# EAGLE design IDC (EAGLE 6.0)
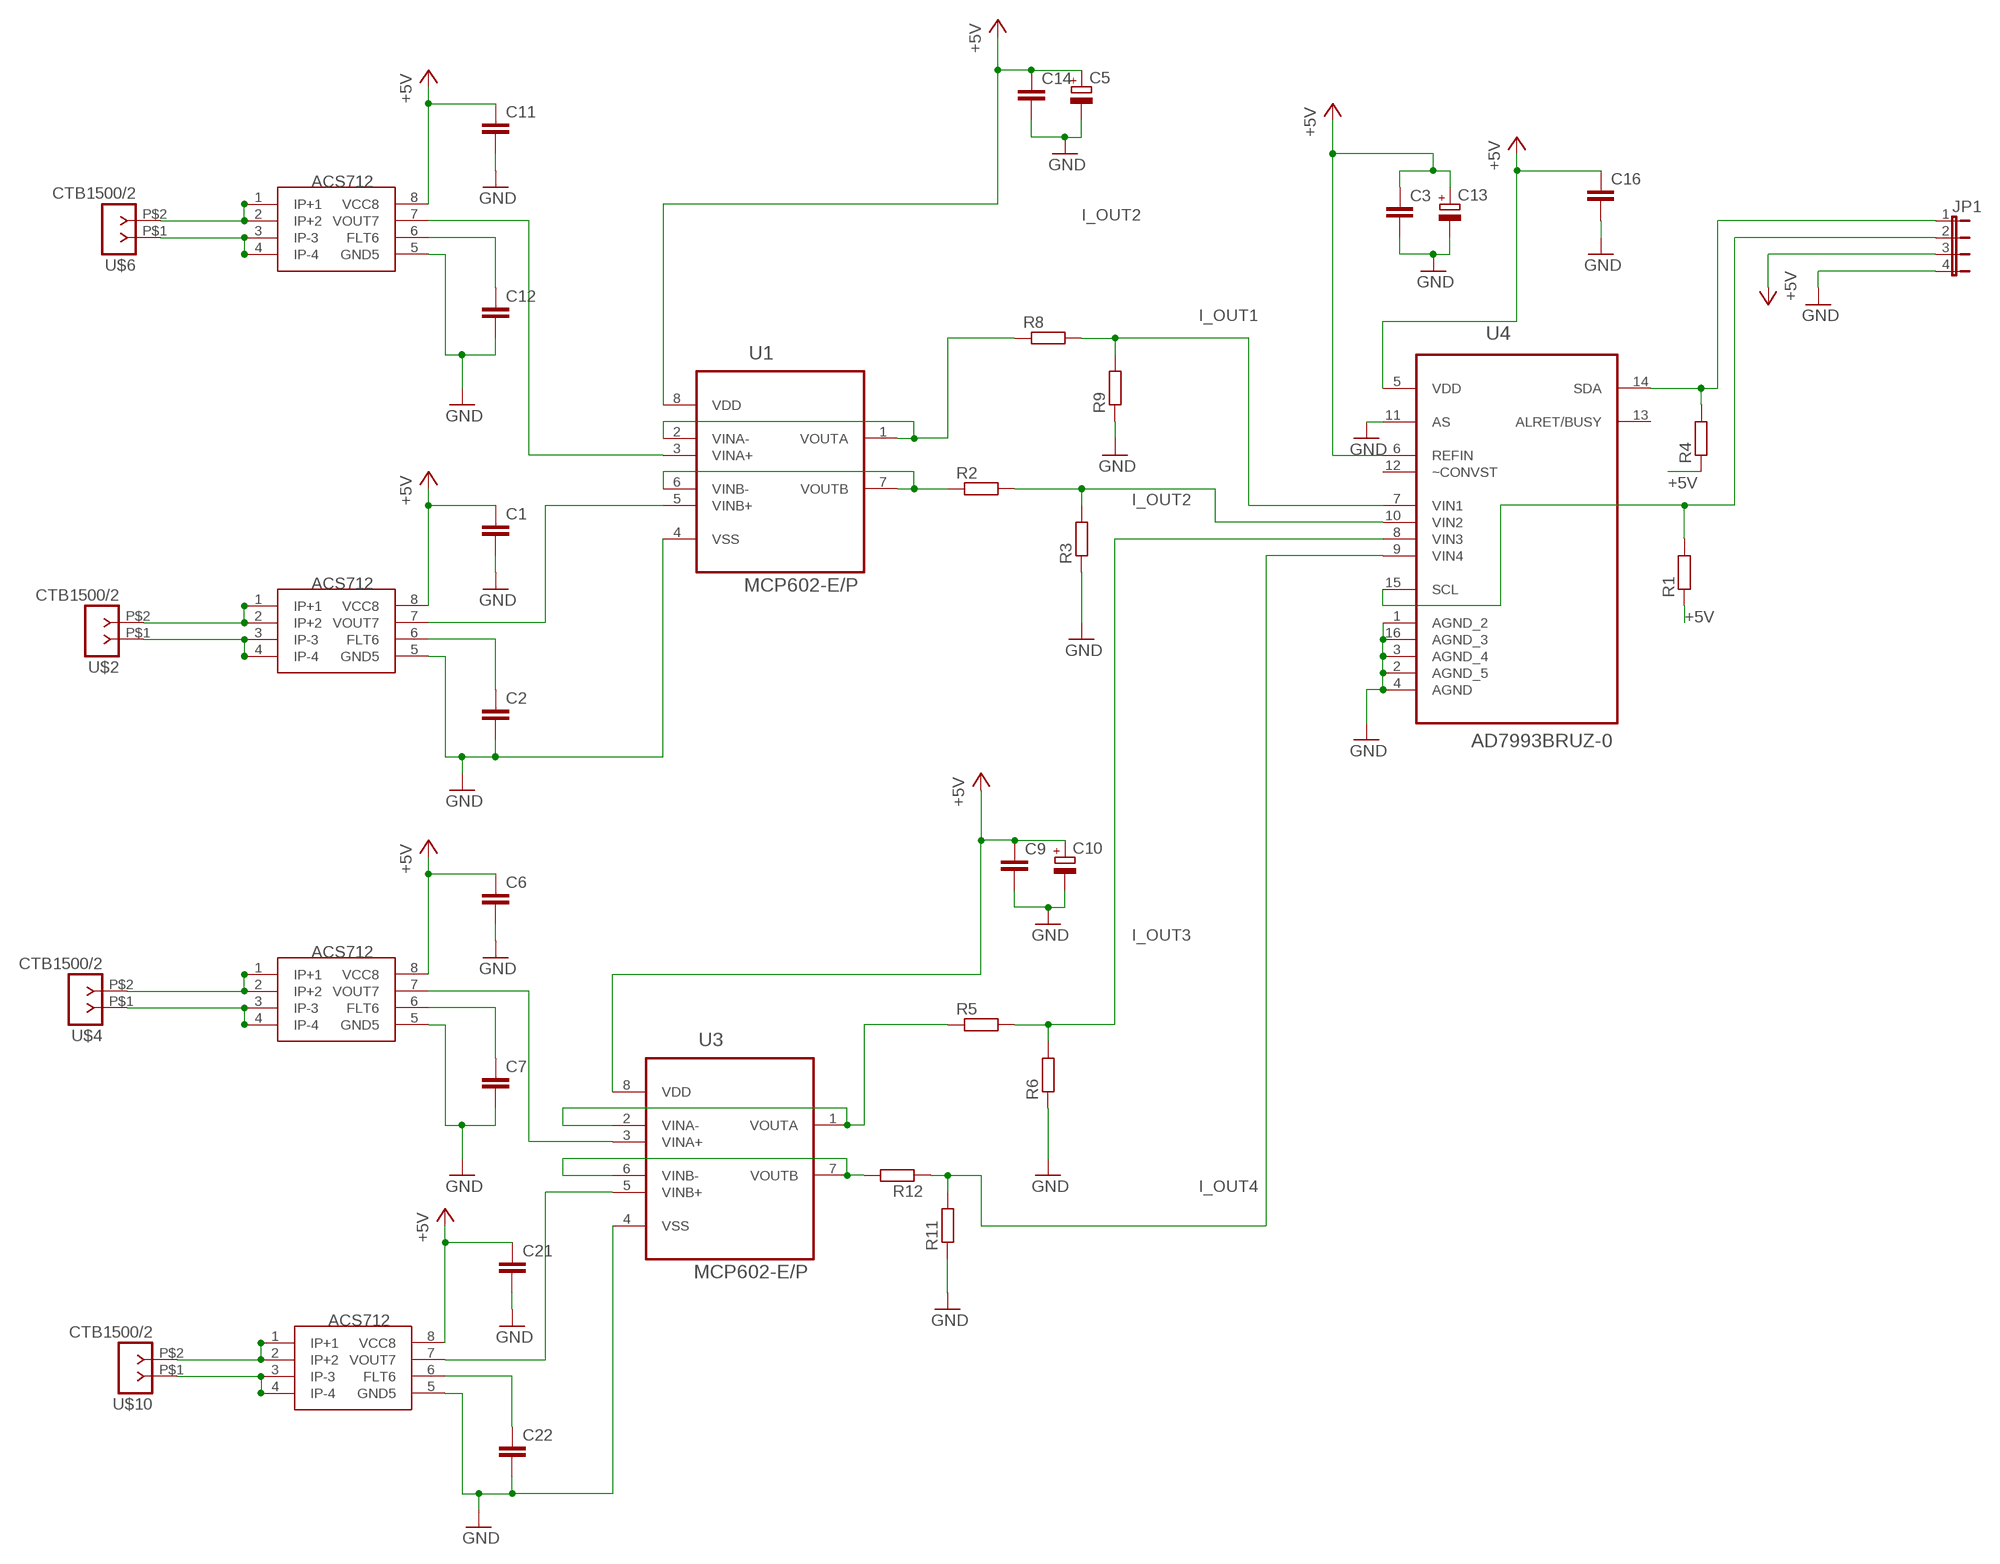
[diagram p0: schematic, sheet 1]

## Parts
C1  C-EU025-024X044  [C025-024X044]
C2  C-EU025-024X044  [C025-024X044]
C3  C-EU025-024X044  [C025-024X044]
C5  CPOL-EUE2-4  [E2-4]
C6  C-EU025-024X044  [C025-024X044]
C7  C-EU025-024X044  [C025-024X044]
C9  C-EU025-024X044  [C025-024X044]
C10  CPOL-EUE2-4  [E2-4]
C11  C-EU025-024X044  [C025-024X044]
C12  C-EU025-024X044  [C025-024X044]
C13  CPOL-EUE2-4  [E2-4]
C14  C-EU025-024X044  [C025-024X044]
C16  C-EU025-025X050  [C025-025X050]
C21  C-EU025-024X044  [C025-024X044]
C22  C-EU025-024X044  [C025-024X044]
JP1  JP4E  [JP4]
R1  R-EU_0207/7  [0207/7]
R2  R-EU_0207/7  [0207/7]
R3  R-EU_0207/7  [0207/7]
R4  R-EU_0207/7  [0207/7]
R5  R-EU_0207/7  [0207/7]
R6  R-EU_0207/7  [0207/7]
R8  R-EU_0207/7  [0207/7]
R9  R-EU_0207/7  [0207/7]
R11  R-EU_0207/7  [0207/7]
R12  R-EU_0207/7  [0207/7]
U1  MCP602-E/P  [DIP254P762X508-8P]
U3  MCP602-E/P  [DIP254P762X508-8P]
U4  AD7993BRUZ-0  [SOP65P640X120-16N]
U$1  ACS712  [SO8]
U$2  CTB1500/2  [CTB1500-2]
U$3  ACS712  [SO8]
U$4  CTB1500/2  [CTB1500-2]
U$5  ACS712  [SO8]
U$6  CTB1500/2  [CTB1500-2]
U$9  ACS712  [SO8]
U$10  CTB1500/2  [CTB1500-2]

## Nets
+5V: C1.1 C3.1 C5.+ C6.1 C9.1 C10.+ C11.1 C13.+ C14.1 C16.1 C21.1 JP1.3 R1.1 R4.1 U1.8(VDD) U3.8(VDD) U4.5(VDD) U4.6(REFIN) U$1.8(VCC8) U$3.8(VCC8) U$5.8(VCC8) U$9.8(VCC8)
GND: C1.2 C2.2 C3.2 C5.- C6.2 C7.2 C9.2 C10.- C11.2 C12.2 C13.- C14.2 C16.2 C21.2 C22.2 JP1.4 R3.1 R6.1 R9.1 R11.1 U1.4(VSS) U3.4(VSS) U4.1(AGND_2) U4.2(AGND_5) U4.3(AGND_4) U4.4(AGND) U4.11(AS) U4.16(AGND_3) U$1.5(GND5) U$3.5(GND5) U$5.5(GND5) U$9.5(GND5)
I_OUT: R2.1 U1.6(VINB-) U1.7(VOUTB)
I_OUT1: R8.2 R9.2 U4.7(VIN1)
I_OUT2: R2.2 R3.2 R8.1 U1.1(VOUTA) U1.2(VINA-) U4.10(VIN2)
I_OUT3: R5.2 R6.2 U4.8(VIN3)
I_OUT4: R11.2 R12.1 U4.9(VIN4)
N$1: JP1.1 R4.2 U4.14(SDA)
N$2: U$1.3(IP-3) U$1.4(IP-4) U$2.P$1
N$3: JP1.2 R1.2 U4.15(SCL)
N$4: C2.1 U$1.6(FLT6)
N$5: U$3.3(IP-3) U$3.4(IP-4) U$4.P$1
N$6: U3.5(VINB+) U$9.7(VOUT7)
N$8: C7.1 U$3.6(FLT6)
N$9: U1.5(VINB+) U$1.7(VOUT7)
N$11: R5.1 U3.1(VOUTA) U3.2(VINA-)
N$12: U3.3(VINA+) U$3.7(VOUT7)
N$14: U$5.3(IP-3) U$5.4(IP-4) U$6.P$1
N$15: C12.1 U$5.6(FLT6)
N$16: U$5.1(IP+1) U$5.2(IP+2) U$6.P$2
N$17: U$1.1(IP+1) U$1.2(IP+2) U$2.P$2
N$18: U1.3(VINA+) U$5.7(VOUT7)
N$19: U$3.1(IP+1) U$3.2(IP+2) U$4.P$2
N$20: U$9.1(IP+1) U$9.2(IP+2) U$10.P$2
N$21: R12.2 U3.6(VINB-) U3.7(VOUTB)
N$26: U$9.3(IP-3) U$9.4(IP-4) U$10.P$1
N$27: C22.1 U$9.6(FLT6)
Unconnected: U4.12(~CONVST) U4.13(ALRET/BUSY)

## Library data of the parts
C1-C3 C6 C7 C9 C11 C12 C14 C16 C21 C22 = resistor:C-EU: CAPACITOR, European symbol
C5 C10 C13 = resistor:CPOL-EU: POLARIZED CAPACITOR, European symbol
JP1 = jumper:JP4E: JUMPER
R1-R6 R8 R9 R11 R12 = resistor:R-EU_: RESISTOR, European symbol
U1 U3 = MCP:MCP602-E/P: IC, 2.7V to 5.5V Single-Supply CMOS Dual Op Amps,DIP-8; MPN: MCP602-E/P; OC_FARNELL: 1852042; OC_NEWARK: 88H9870; PACKAGE: DIP-8; SUPPLIER: Microchip
U4 = ADC:AD7993BRUZ-0: ADC; MPN: AD7993BRUZ-0; OC_FARNELL: 1078309; OC_NEWARK: 59K6101; PACKAGE: TSSOP-16; SUPPLIER: Analog Devices
U$1 U$3 U$5 U$9 = eko-parts:ACS712
U$2 U$4 U$6 U$10 = eko-parts:CTB1500/2

## Board
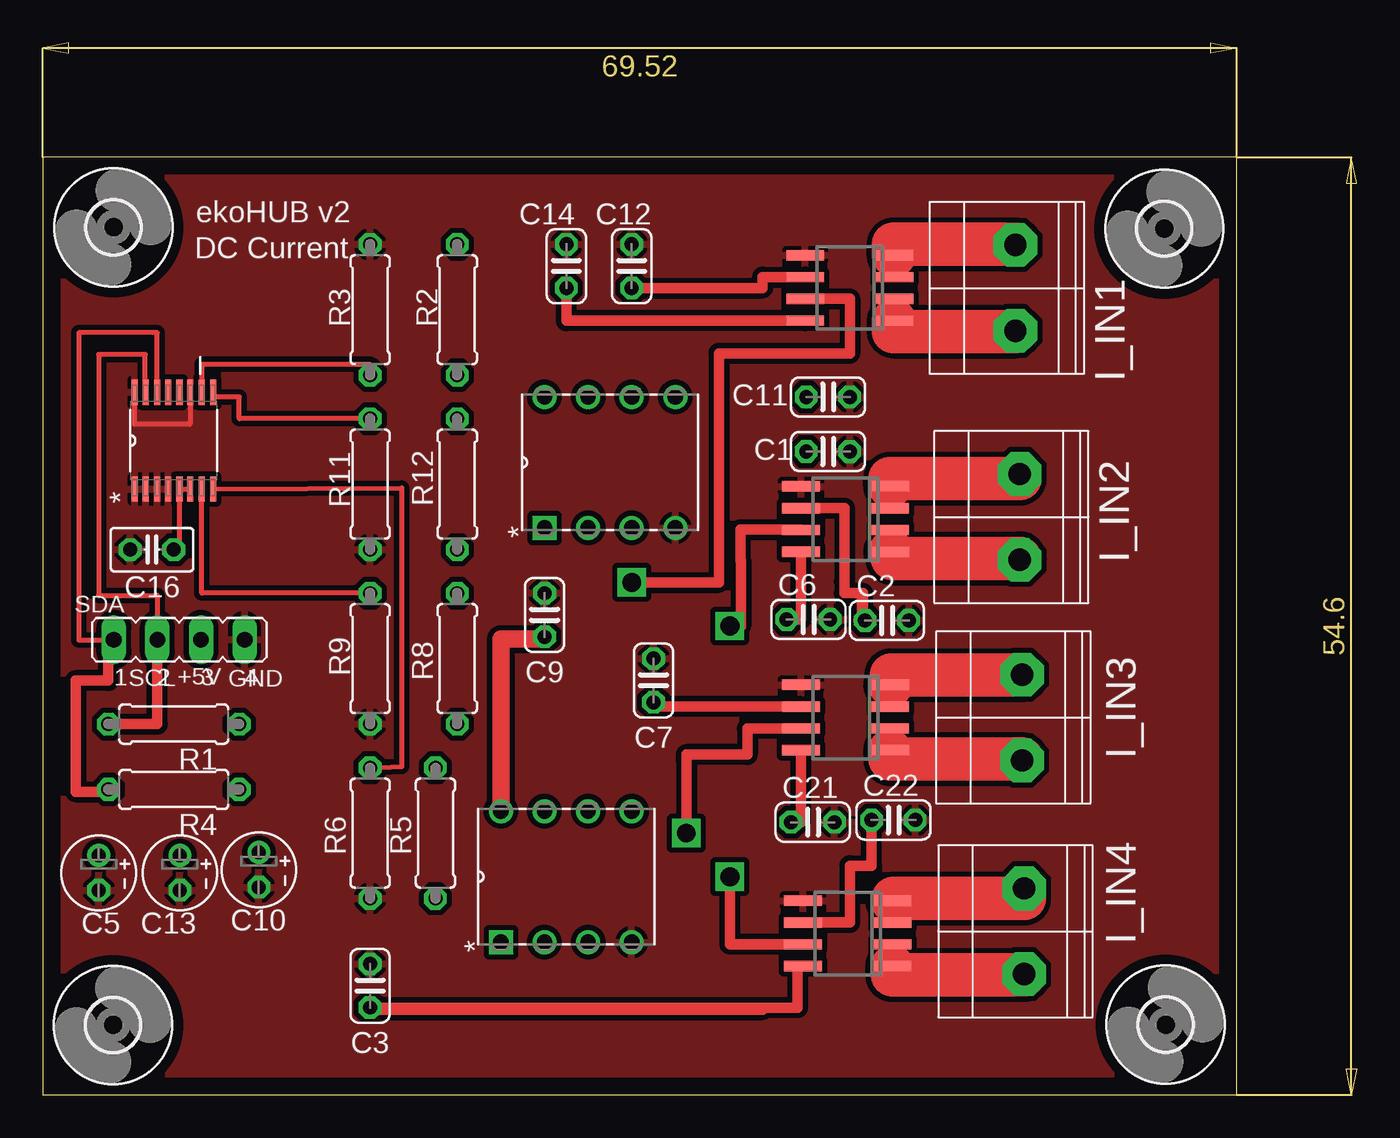
[diagram p1: board, top side]
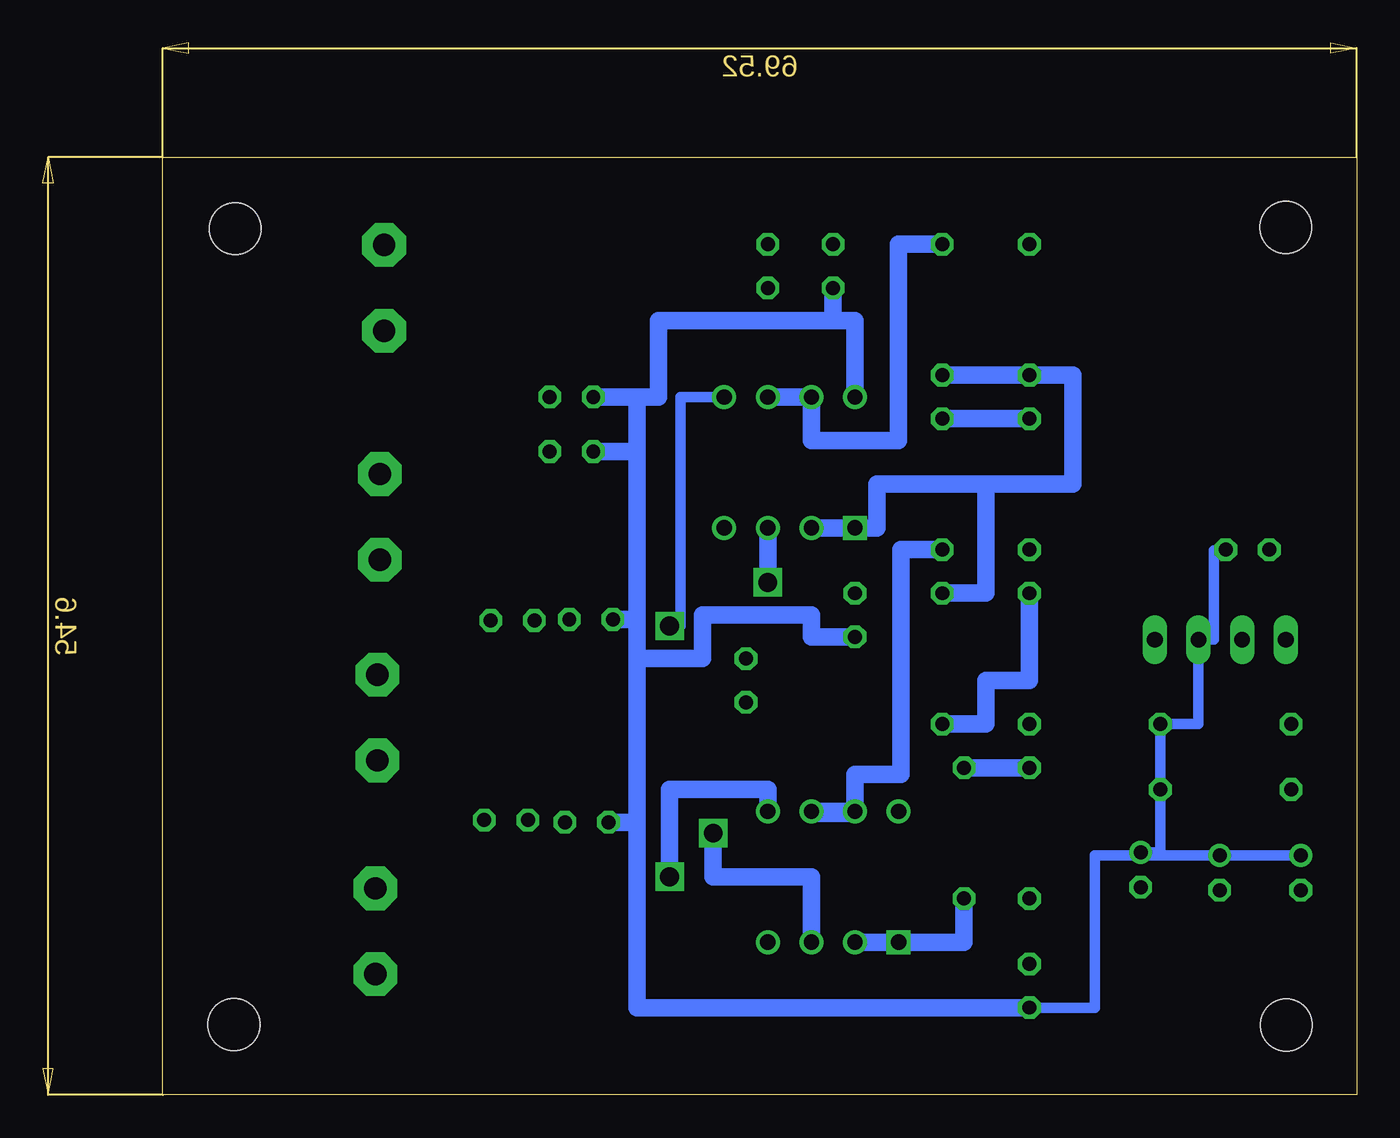
[diagram p2: board, bottom side, seen from below]

Size 69.52 x 54.6 mm. Coordinates in mm from the lower left corner, seen from the top.
Outline: 0,0 69.52,0 69.52,54.6 0,54.6 0,0
Copper layers (1*16): Top 0.035mm / dielectric 1.5mm / Bottom 0.035mm
Design rules: minimum track width 10mil, minimum drill 24mil, track to track 12mil, track to pad 12mil, pad to pad 12mil, via to via 12mil, smd to smd 12mil, copper to edge 40mil, drill to drill 8mil, minimum pad ring 10mil, minimum via ring 8mil, stop-mask expansion 4mil, vias tented up to drill 0mil, thermal gap 10mil

### Footprints (pad centres in the part's own frame; a part is rotated, then mirrored left to right if it is on the bottom)
C025-024X044 = drill 0.813 octagon: 1 -1.27,0; 2 1.27,0
E2-4 = drill 0.813 pad 1.27: + -1.016,0 | drill 0.813 pad 1.27 octagon: - 1.016,0
C025-025X050 = drill 0.813 octagon: 1 -1.27,0; 2 1.27,0
JP4 = drill 0.914 long: 1 -3.81,0; 2 -1.27,0; 3 1.27,0; 4 3.81,0
0207/7 = drill 0.813 octagon: 1 -3.81,0; 2 3.81,0
DIP254P762X508-8P = drill 0.889 square: 1 -7.62,7.62 | drill 0.889: 2 -7.62,5.08; 3 -7.62,2.54; 4 -7.62,0; 5 0,0; 6 0,2.54; 7 0,5.08; 8 0,7.62
SOP65P640X120-16N = smd 1.473 x 0.356: 1 -2.819,2.286; 2 -2.819,1.626; 3 -2.819,0.965; 4 -2.819,0.33; 5 -2.819,-0.33; 6 -2.819,-0.965; 7 -2.819,-1.626; 8 -2.819,-2.286; 9 2.819,-2.286; 10 2.819,-1.626; 11 2.819,-0.965; 12 2.819,-0.33; 13 2.819,0.33; 14 2.819,0.965; 15 2.819,1.626; 16 2.819,2.286
SO8 = smd 0.6 x 2.2: 1 -1.905,-2.6; 2 -0.635,-2.6; 3 0.635,-2.6; 4 1.905,-2.6; 5 1.905,2.6; 6 0.635,2.6; 7 -0.635,2.6; 8 -1.905,2.6
CTB1500-2 = drill 1.3 pad 2.54 octagon: P$1 -2.5,0.5; P$2 2.5,0.5
3,0 = hole 3: 0,0

### Placement (x,y rotation side)
C1  45.72,37.47 0 top
C2  49.15,27.62 0 top
C3  19.05,6.35 90 top
C5  3.25,12.93 270 top
C6  44.58,27.69 0 top
C7  35.56,24.13 90 top
C9  29.21,27.94 90 top
C10  12.57,13.11 270 top
C11  45.72,40.64 0 top
C12  34.29,48.26 90 top
C13  7.98,12.93 270 top
C14  30.48,48.26 90 top
C16  6.35,31.75 180 top
C21  44.83,15.88 0 top
C22  49.53,16 0 top
JP1  7.94,26.5 0 top
R1  7.62,21.59 180 top
R2  24.13,45.72 270 top
R3  19.05,45.72 270 top
R4  7.62,17.78 180 top
R5  22.86,15.24 90 top
R6  19.05,15.24 90 top
R8  24.13,25.4 270 top
R9  19.05,25.4 90 top
R11  19.05,35.56 90 top
R12  24.13,35.56 270 top
U1  36.83,40.64 90 top
U3  34.29,16.51 90 top
U4  7.62,38.1 90 top
U$1  46.74,33.53 90 top
U$2  56.39,33.66 270 top
U$3  46.74,21.97 90 top
U$4  56.52,21.97 270 top
U$5  46.99,46.99 90 top
U$6  56.13,46.99 270 top
U$7  [3,0]  4.11,50.52 0 top
U$8  [3,0]  65.38,4.09 0 top
U$9  46.86,9.4 90 top
U$10  56.64,9.53 270 top
U$11  [3,0]  4.09,4.06 0 top
U$12  [3,0]  65.3,50.44 0 top

### Tracks (layer width: path | path; a pad name or v marks a point on that pad's centre or on a via)
+5V
  Top 0.305: U4.6 U4.5 7.95,31.75 C16.1
  Top 0.61: U$5.8 30.48,45.09 C14.1 | U$9.8 43.94,7.49 43.94,5.08 41.91,5.08 | 41.91,5.08 C3.1 19.05,4.95 41.91,4.95 41.91,5.08 | C21.1 44.14,15.88 U$3.8 | C6.1 44.14,27.69 U$1.8
  Top 1.016: U3.8 26.67,26.54 29.21,26.54 C9.1
  Bottom 0.61: C5.+ C13.+ 12.57,13.95 | 12.57,13.95 C10.+ 11.43,14.12 R4.1 R1.1 9.21,21.59 JP1.3 8.32,26.5 8.32,31.69 7.62,31.69 C16.1 | 12.57,13.95 15.24,13.95 15.24,5.08 C3.1
  Bottom 1.016: 30.48,45.09 C14.1 | 41.91,15.88 41.91,5.08 C3.1 | 41.91,15.88 41.91,25.4 | 41.91,25.4 38.1,25.4 38.1,27.94 31.75,27.94 31.75,26.67 C9.1 | 41.91,25.4 41.91,27.69 | 41.91,27.69 41.91,37.47 | 41.91,37.47 41.91,40.64 | 41.91,40.64 C11.1 | C1.1 41.91,37.47 | 41.91,40.64 40.64,40.64 40.64,45.09 30.48,45.09 | U1.8 29.21,45.09 30.48,45.09 | C6.1 41.91,27.69 | C21.1 41.91,15.88
GND
  Top 0.305: U4.11 8.57,40.92 8.57,39.05 5.33,39.05 U4.16
  pour Top: 0,54.61 69.85,54.61 69.85,0 0,0
I_OUT
  Bottom 1.016: R2.1 26.67,49.53 26.67,38.1 31.75,38.1 U1.7 U1.6
I_OUT1
  Top 0.305: R9.2 9.25,29.21 U4.7
  Bottom 1.016: R9.2 19.05,24.13 21.59,24.13 21.59,21.59 R8.2
I_OUT2
  Top 0.305: U4.10 9.27,40.92 9.27,42.55 19.05,42.55 R3.2
  Bottom 1.016: R8.1 21.59,29.21 21.59,35.56 | 21.59,41.91 R2.2 R3.2 16.51,41.91 16.51,35.56 21.59,35.56 | U1.2 U1.1 27.94,33.02 27.94,35.56 21.59,35.56
I_OUT3
  Top 0.305: R6.2 20.89,19.11 20.89,35.34 U4.8
  Bottom 1.016: R5.2 R6.2
I_OUT4
  Top 0.305: R11.2 11.43,39.37 11.43,40.64 9.91,40.64 U4.9
  Bottom 1.016: R12.1 R11.2
N$1
  Top 0.305: U4.14 6.67,40.92 6.67,44.39 2.1,44.39 2.1,26.48 4.13,26.48 JP1.1
  Top 0.61: 4.13,26.48 3.81,26.48 3.81,24.13 1.91,24.13 1.91,17.65 3.81,17.65 R4.2
N$2
  Top 0.61: U$1.4 U$1.3
  Top 2.54: U$1.4 49.34,35.88 56.89,35.88 U$2.P$1
N$3
  Top 0.305: U4.15 5.97,40.92 5.97,43.12 3.24,43.12 3.24,29.08 6.67,29.08 JP1.2
  Top 0.61: R1.2 6.67,21.59 JP1.2
N$4
  Top 0.61: U$1.6 46.69,34.16 46.69,29.87 46.67,29.87 46.67,29.21 47.69,29.21 | 47.69,29.21 47.75,29.21 47.75,27.69 47.88,27.69 C2.1 | 47.69,29.21 47.69,27.43
  Top 1.016: C2.1 47.69,27.62
N$5
  Top 0.61: U$3.3 U$3.4
  Top 2.54: U$3.4 49.4,23.88 49.4,24.45 57.02,24.45 U$4.P$1
N$6  (via drill 1.1)
  Top 0.61: U$9.7 40.01,8.76 v40.01,12.7
  Bottom 1.016: v40.01,12.7 40.01,17.78 34.29,17.78 U3.5
N$8
  Top 0.61: U$3.6 35.56,22.61 C7.1
N$9  (via drill 1.1)
  Top 0.61: v40.01,27.3 40.64,27.3 40.64,31.11 40.62,31.11 40.62,32.92 44.14,32.92 U$1.7
  Bottom 0.61: U1.5 39.37,40.64 39.37,27.3 v40.01,27.3
N$11
  Bottom 1.016: R5.1 22.86,8.89 U3.1 U3.2
N$12  (via drill 1.1)
  Top 0.61: v37.47,15.24 37.47,19.43 37.47,19.68 37.47,19.81 41.02,19.81 41.02,21.34 U$3.7
  Bottom 1.016: U3.3 31.75,12.7 37.47,12.7 v37.47,15.24
N$14
  Top 0.61: U$5.4 U$5.3
  Top 2.54: U$5.4 49.53,48.9 49.53,49.53 56.63,49.53 U$6.P$1
N$15
  Top 0.61: C12.1 41.91,46.99 41.91,47.62 U$5.6
N$16
  Top 0.61: U$5.2 U$5.1
  Top 2.54: U$5.1 49.53,45.09 49.53,44.45 56.63,44.45 U$6.P$2
N$17
  Top 0.61: U$1.2 U$1.1
  Top 2.54: U$1.1 49.47,31.62 49.47,31.24 56.89,31.24 U$2.P$2
N$18  (via drill 1.1)
  Top 0.61: U$5.7 46.99,46.35 46.99,43.18 39.37,43.18 39.37,29.84 v34.29,29.84
  Bottom 1.016: U1.3 v34.29,29.84
N$19
  Top 0.61: U$3.2 U$3.1
  Top 2.54: U$3.1 49.34,19.56 57.02,19.56 U$4.P$2
N$20
  Top 0.61: U$9.2 U$9.1
  Top 2.54: U$9.1 49.47,6.99 57.14,6.99 U$10.P$2
N$21
  Bottom 1.016: R12.2 26.54,31.75 26.54,18.67 29.21,18.67 U3.7 | 29.21,16.38 31.75,16.38 U3.6 29.34,16.51 | U3.7 29.21,16.38 | 29.21,16.38 29.08,16.38 29.08,16.64 29.34,16.64 29.34,16.51 | U3.7 29.34,16.51
N$26
  Top 0.61: U$9.3 U$9.4
  Top 2.54: U$9.4 49.53,11.3 49.53,11.43 57.14,11.43 U$10.P$1
N$27
  Top 0.61: U$9.6 46.99,10.03 46.99,13.34 48.26,13.34 C22.1

### Text on the board
tPlace: ekoHUB v2 | DC Current | I_IN1 | I_IN2 | SDA | SCL | +5V | GND | I_IN3 | I_IN4